# EAGLE design cry_gold (EAGLE 9.5.2)
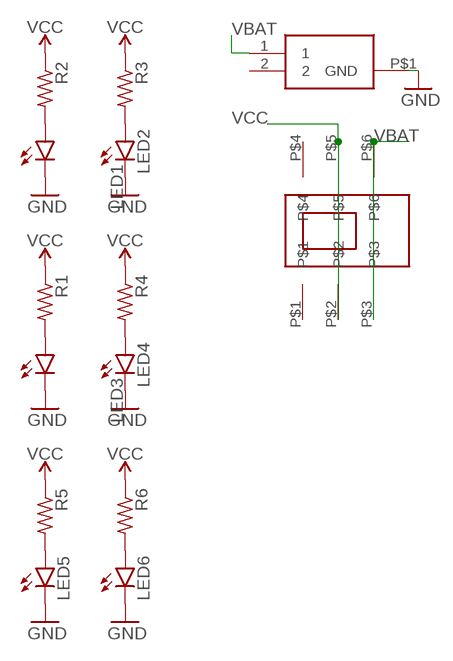
[diagram p0: schematic, sheet 1]

## Parts
LED1  LEDCHIP-LED0805  [CHIP-LED0805]
LED2  LEDCHIP-LED0805  [CHIP-LED0805]
LED3  LEDCHIP-LED0805  [CHIP-LED0805]
LED4  LEDCHIP-LED0805  [CHIP-LED0805]
LED5  LEDCHIP-LED0805  [CHIP-LED0805]
LED6  LEDCHIP-LED0805  [CHIP-LED0805]
R1  R-US_R0603  [R0603]
R2  R-US_R0603  [R0603]
R3  R-US_R0603  [R0603]
R4  R-US_R0603  [R0603]
R5  R-US_R0603  [R0603]
R6  R-US_R0603  [R0603]
U$1  CL-SB-22A-02T-SLIDE-SWITCH-TUCKED-PADS  [CL-SB-22A-02T-DPDT-COMPACT-SWITCH]
VBAT  BAT-HLD-012-SMT  [BATHLD012SMT]

## Nets
GND: LED1.C LED2.C LED3.C LED4.C LED5.C LED6.C VBAT.P$1(GND)
N$1: LED1.A R2.2
N$2: LED3.A R1.2
N$3: LED5.A R5.2
N$4: LED2.A R3.2
N$5: LED4.A R4.2
N$6: LED6.A R6.2
VBAT: U$1.P$3 U$1.P$6 VBAT.1
VCC: R1.1 R2.1 R3.1 R4.1 R5.1 R6.1 U$1.P$2 U$1.P$5
Unconnected: U$1.P$1 U$1.P$4 VBAT.2

## Library data of the parts
LED1-LED6 = led:LED: LED OSRAM: - CHIPLED LG R971, LG N971, LY N971, LG Q971, LY Q971, LO R971, LY R971 LH N974, LH R974 LS Q976, LO Q976, LY Q976 LO Q996 - Hyper CHIPLED LW Q18S LB Q993, LB Q99A, LB R99A - SideLED LS A670, LO A670, LY A670, LG A670, LP A670 LB A673, LV A673, LT A673, LW A673 LH A674 LY A675 LS A676, LA A676, LO A676, LY A676, LW A676 LS A679, LY A679, LG A679 - Hyper Micro SIDELED® LS Y876, LA Y876, LO Y876, LY Y876 LT Y87S - SmartLED LW L88C, LW L88S LB L89C, LB L89S, LG L890 LS L89K, LO L89K, LY L89K LS L896, LA L896, LO L896, LY L896 - TOPLED LS T670, LO T670, LY T670, LG T670, LP T670 LSG T670, LSP T670, LSY T670, LOP T670, LYG T670 LG T671, LOG T671, LSG T671 LB T673, LV T673, LT T673, LW T673 LH T674 LS T676, LA T676, LO T676, LY T676, LB T676, LH T676, LSB T676, LW T676 LB T67C, LV T67C, LT T67C, LS T67K, LO T67K, LY T67K, LW E67C LS E67B, LA E67B, LO E67B, LY E67B, LB E67C, LV E67C, LT E67C LW T67C LS T679, LY T679, LG T679 LS T770, LO T770, LY T770, LG T770, LP T770 LB T773, LV T773, LT T773, LW T773 LH T774 LS E675, LA E675, LY E675, LS T675 LS T776, LA T776, LO T776, LY T776, LB T776 LHGB T686 LT T68C, LB T68C - Hyper Mini TOPLED® LB M676 - Mini TOPLED Santana® LG M470 LS M47K, LO M47K, LY M47K Source: http://www.osram.convergy.de LUXEON: - LUMILED® LXK2-PW12-R00, LXK2-PW12-S00, LXK2-PW14-U00, LXK2-PW14-V00 LXK2-PM12-R00, LXK2-PM12-S00, LXK2-PM14-U00 LXK2-PE12-Q00, LXK2-PE12-R00, LXK2-PE12-S00, LXK2-PE14-T00, LXK2-PE14-U00 LXK2-PB12-K00, LXK2-PB12-L00, LXK2-PB12-M00, LXK2-PB14-N00, LXK2-PB14-P00, LXK2-PB14-Q00 LXK2-PR12-L00, LXK2-PR12-M00, LXK2-PR14-Q00, LXK2-PR14-R00 LXK2-PD12-Q00, LXK2-PD12-R00, LXK2-PD12-S00 LXK2-PH12-R00, LXK2-PH12-S00 LXK2-PL12-P00, LXK2-PL12-Q00, LXK2-PL12-R00 Source: www.luxeon.com KINGBRIGHT: KA-3528ASYC Source: www.kingbright.com
R1-R6 = rcl:R-US_: RESISTOR, American symbol; SPICEPREFIX: R
U$1 = electroninks:CL-SB-22A-02T-SLIDE-SWITCH-TUCKED-PADS
VBAT = SamacSys_Parts:BAT-HLD-012-SMT: Coin Cell Battery Holders Bat Hld CR1216/1225 Surface Mount Source: Datasheet <https://componentsearchengine.com/Datasheets/1/BAT-HLD-012-SMT.pdf>; DESCRIPTION: Coin Cell Battery Holders Bat Hld CR1216/1225 Surface Mount; HEIGHT: 3mm; MANUFACTURER_NAME: Linx Technologies; MANUFACTURER_PART_NUMBER: BAT-HLD-012-SMT; MOUSER_PART_NUMBER: 712-BAT-HLD-012-SMT; MOUSER_PRICE-STOCK: https://www.mouser.com/Search/Refine.aspx?Keyword=712-BAT-HLD-012-SMT

## Board
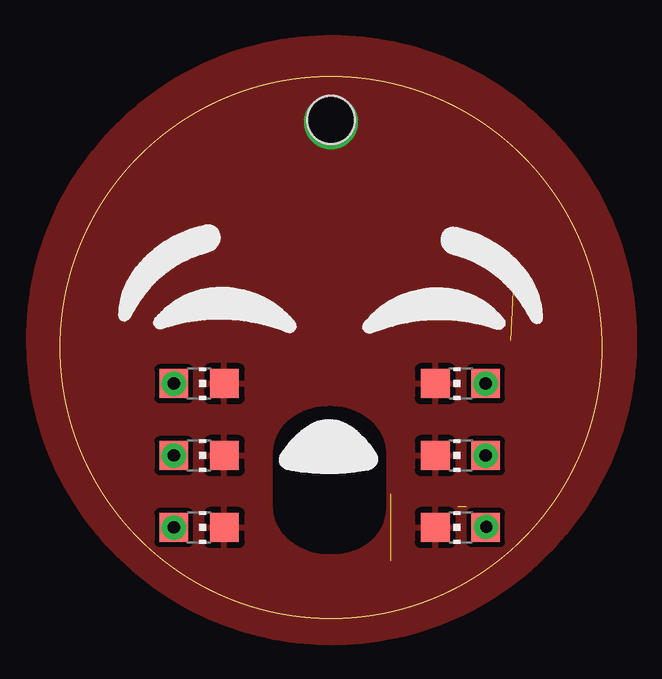
[diagram p1: board, top side]
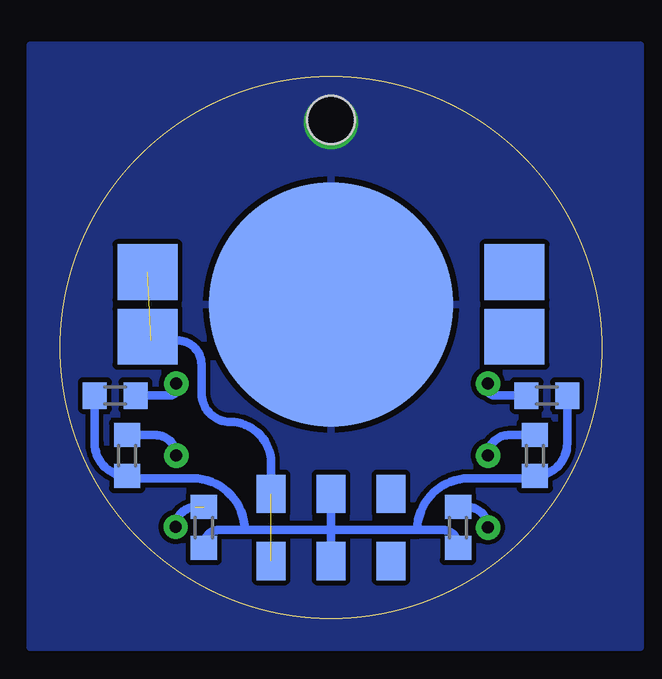
[diagram p2: board, bottom side, seen from below]

Size 22.6 x 22.6 mm. Coordinates in mm from the lower left corner, seen from the top.
Outline: circle at 11.3,11.3 radius 11.3
Copper layers (1*16): Top 0.035mm / dielectric 1.5mm / Bottom 0.035mm
Design rules "SparkFun *": minimum track width 8mil, minimum drill 20mil, track to track 8mil, track to pad 8mil, pad to pad 8mil, via to via 8mil, smd to smd 8mil, copper to edge 0mil, drill to drill 8mil, minimum pad ring 12mil, minimum via ring 10mil, stop-mask expansion 4mil, vias tented up to drill 1.6mm, thermal gap 10mil
Holes 2 mm at 11.3,20.8

### Footprints (pad centres in the part's own frame; a part is rotated, then mirrored left to right if it is on the bottom)
CHIP-LED0805 = smd 1.2 x 1.2: A 0,-1.05; C 0,1.05
R0603 = smd 1 x 1.1: 1 -0.85,0; 2 0.85,0
CL-SB-22A-02T-DPDT-COMPACT-SWITCH = smd 1.2 x 1.6: P$1 -2.5,-1.4; P$2 0,-1.4; P$3 2.5,-1.4; P$4 -2.5,1.4; P$5 0,1.4; P$6 2.5,1.4
BATHLD012SMT = smd 2.5 x 2.325: 1 -7.65,1.35; 2 7.65,1.35; P$2 -7.65,-1.35; P$3 7.65,-1.35 | smd 10.2 x 10.2: P$1 0,0

### Placement (x,y rotation side)
LED1  5.8,9.8 270 top
LED2  16.7,9.8 90 top
LED3  5.8,6.8 270 top
LED4  16.7,6.8 90 top
LED5  5.8,3.8 270 top
LED6  16.7,3.8 90 top
R1  2.8,6.8 90 bottom
R2  2.3,9.3 180 bottom
R3  20.3,9.3 0 bottom
R4  19.8,6.8 90 bottom
R5  6,3.8 90 bottom
R6  16.6,3.8 90 bottom
U$1  11.3,3.8 180 bottom
VBAT  11.3,13.1 0 bottom

### Tracks (layer width: path | path; a pad name or v marks a point on that pad's centre or on a via)
GND  (via drill 1.5)
  other vias: 11.3,20.7
  pour Bottom: -1.6,23.9 23.84,23.9 23.84,-1.2 -1.6,-1.2
  pour Top (rank 3): 11.33,24.28 11.01,24.28 10.69,24.27 10.38,24.25 10.06,24.22 9.85,24.2 9.53,24.16 9.22,24.11 8.91,24.05 8.6,23.99 8.29,23.92 8.03,23.85 7.73,23.77 7.42,23.67 7.12,23.57 6.82,23.46 6.53,23.35 6.24,23.22 5.99,23.11 5.71,22.98 5.42,22.83 5.15,22.68 4.87,22.52 4.6,22.36 4.33,22.19 4.2,22.1 4.03,21.98 3.77,21.79 3.52,21.6 3.27,21.4 3.02,21.2 2.79,20.99 2.59,20.81 2.37,20.59 2.14,20.36 1.93,20.13 1.75,19.93 1.54,19.69 1.34,19.44 1.15,19.19 0.96,18.93 0.78,18.67 0.7,18.54 0.58,18.36 0.42,18.09 0.26,17.82 0.1,17.54 -0.04,17.26 -0.18,16.97 -0.31,16.68 -0.41,16.44 -0.53,16.14 -0.64,15.85 -0.74,15.54 -0.84,15.24 -0.93,14.94 -1,14.63 -1.08,14.32 -1.13,14.06 -1.17,13.85 -1.22,13.54 -1.26,13.22 -1.3,12.91 -1.33,12.59 -1.35,12.28 -1.36,11.96 -1.36,11.64 -1.36,11.32 -1.35,11.11 -1.34,10.8 -1.31,10.48 -1.28,10.16 -1.24,9.85 -1.19,9.53 -1.13,9.22 -1.07,8.91 -1,8.6 -0.92,8.29 -0.83,7.99 -0.74,7.69 -0.63,7.39 -0.52,7.09 -0.41,6.79 -0.32,6.6 -0.26,6.45 -0.13,6.16 0.02,5.88 0.16,5.6 0.32,5.32 0.48,5.05 0.65,4.78 0.79,4.56 0.97,4.3 1.16,4.04 1.35,3.79 1.55,3.54 1.73,3.34 1.94,3.1 2.15,2.87 2.37,2.64 2.56,2.46 2.8,2.24 3.03,2.03 3.28,1.83 3.52,1.63 3.78,1.44 3.95,1.31 4.08,1.22 4.34,1.04 4.61,0.87 4.88,0.7 5.15,0.54 5.43,0.39 5.71,0.25 5.95,0.13 6.24,0 6.53,-0.12 6.83,-0.24 7.13,-0.35 7.43,-0.45 7.73,-0.54 7.99,-0.62 8.29,-0.7 8.6,-0.77 8.91,-0.83 9.23,-0.89 9.54,-0.94 9.85,-0.98 10.17,-1.01 10.49,-1.03 10.7,-1.05 11,-1.06 11.09,2.63 10.95,2.64 10.84,2.66 10.74,2.68 10.58,2.71 10.43,2.75 10.28,2.8 10.13,2.86 9.99,2.93 9.85,3.01 9.76,3.06 9.72,3.09 9.63,3.15 9.59,3.19 9.51,3.25 9.47,3.29 9.39,3.36 9.35,3.4 9.28,3.48 9.25,3.52 9.18,3.6 9.15,3.65 9.1,3.73 9.07,3.78 9.02,3.87 8.97,3.97 8.93,4.07 8.9,4.17 8.89,4.22 8.86,4.32 8.85,4.37 8.84,4.48 8.83,4.53 8.83,4.64 8.83,6.96 8.84,7.07 8.85,7.17 8.86,7.23 8.88,7.33 8.91,7.43 8.95,7.53 8.99,7.63 9.03,7.72 9.08,7.82 9.14,7.91 9.2,7.99 9.27,8.07 9.34,8.15 9.42,8.23 9.49,8.3 9.57,8.37 9.66,8.43 9.75,8.49 9.84,8.55 9.93,8.6 10.02,8.65 10.12,8.69 10.27,8.75 10.37,8.78 10.47,8.81 10.57,8.84 10.67,8.86 10.78,8.88 10.88,8.9 10.99,8.91 11.15,8.92 11.25,8.92 11.41,8.92 11.52,8.91 11.62,8.9 11.73,8.88 11.83,8.86 11.93,8.84 12.04,8.81 12.14,8.78 12.29,8.73 12.38,8.69 12.48,8.64 12.57,8.59 12.66,8.54 12.75,8.48 12.84,8.42 12.92,8.35 13,8.29 13.08,8.21 13.15,8.14 13.22,8.06 13.29,7.97 13.35,7.89 13.41,7.8 13.43,7.75 13.48,7.66 13.52,7.56 13.56,7.46 13.59,7.36 13.62,7.26 13.63,7.21 13.64,7.1 13.65,7 13.65,4.51 13.65,4.46 13.63,4.35 13.62,4.3 13.6,4.2 13.58,4.09 13.56,4.04 13.52,3.94 13.48,3.85 13.46,3.8 13.41,3.71 13.38,3.66 13.32,3.57 13.26,3.49 13.23,3.45 13.19,3.41 13.12,3.33 13.04,3.25 13.01,3.22 12.92,3.15 12.88,3.12 12.8,3.06 12.75,3.03 12.66,2.97 12.62,2.95 12.52,2.9 12.47,2.88 12.38,2.83 12.23,2.78 12.08,2.73 11.92,2.69 11.77,2.66 11.61,2.64 11.5,2.63 11.4,2.63 11.12,2.63 11.03,-1.06 11.33,-1.06 11.65,-1.06 11.97,-1.05 12.28,-1.03 12.6,-1 12.92,-0.96 13.23,-0.92 13.44,-0.89 13.75,-0.83 14.01,-0.78 14.32,-0.71 14.63,-0.63 14.93,-0.54 15.24,-0.45 15.54,-0.34 15.84,-0.23 16.13,-0.12 16.42,0.01 16.82,0.18 17.23,0.4 17.51,0.55 17.79,0.71 18.06,0.87 18.32,1.05 18.46,1.13 18.63,1.26 18.89,1.44 19.14,1.63 19.39,1.83 19.63,2.04 19.87,2.25 20.06,2.43 20.29,2.65 20.51,2.88 20.73,3.11 20.94,3.35 21.11,3.55 21.31,3.8 21.5,4.05 21.69,4.31 21.84,4.52 22.01,4.79 22.18,5.06 22.34,5.33 22.5,5.61 22.62,5.84 22.76,6.13 22.9,6.41 23.02,6.7 23.14,7 23.26,7.3 23.34,7.55 23.44,7.85 23.53,8.15 23.62,8.46 23.69,8.77 23.76,9.08 23.82,9.39 23.87,9.7 23.92,10.02 23.95,10.33 23.98,10.65 24,10.96 24.01,11.28 24.02,11.6 24.02,11.81 24.01,12.13 23.99,12.44 23.97,12.76 23.94,13.08 23.9,13.39 23.85,13.71 23.79,14.02 23.73,14.33 23.66,14.64 23.58,14.95 23.49,15.25 23.4,15.55 23.29,15.85 23.18,16.15 23.07,16.45 22.96,16.69 22.83,16.98 22.69,17.27 22.55,17.55 22.42,17.78 22.26,18.06 22.1,18.33 21.92,18.59 21.78,18.81 21.59,19.07 21.4,19.33 21.2,19.57 21,19.82 20.79,20.06 20.69,20.17 20.54,20.33 20.32,20.56 20.09,20.78 19.86,21 19.62,21.21 19.38,21.41 19.17,21.58 18.92,21.77 18.66,21.95 18.4,22.14 18.18,22.28 17.91,22.45 17.64,22.61 17.36,22.76 17.08,22.91 16.84,23.03 16.56,23.16 16.26,23.29 15.97,23.41 15.67,23.52 15.37,23.63 15.07,23.72 14.82,23.8 14.51,23.88 14.2,23.96 13.89,24.03 13.58,24.09 13.27,24.14 12.95,24.18 12.64,24.22 12.32,24.25 12.01,24.27 11.69,24.28 11.37,24.28
N$1  (via drill 0.51)
  Top 0.35: 4.75,9.58 LED1.A
  Bottom 0.35: R2.2 4.47,9.3 arc90 4.75,9.58 LED1.A
  other vias: 4.75,9.8
N$2  (via drill 0.51)
  Bottom 0.35: R1.2 3.9,7.65 arc-90 LED3.A
  other vias: 4.75,6.8
N$3  (via drill 0.51)
  Top 0.35: 4.67,3.88 arc90 LED5.A
  Bottom 0.35: R5.2 5.6,4.65 arc90 LED5.A
  other vias: 4.75,3.8
N$4  (via drill 0.51)
  Top 0.35: 17.75,9.58 LED2.A
  Bottom 0.35: R3.2 18.03,9.3 arc-90 17.75,9.58 LED2.A
  other vias: 17.75,9.8
N$5  (via drill 0.51)
  Bottom 0.35: R4.2 18.6,7.65 arc90 LED4.A
  other vias: 17.75,6.8
N$6  (via drill 0.51)  (1 unrouted)
  Top 0.35: v17.78,3.83 arc-90 LED6.A
  Bottom 0.35: 16.96,4.65 arc-90 v17.78,3.83
VBAT  (2 unrouted)
  Bottom 0.35: 13.8,5.46 U$1.P$3 13.8,6.5 arc-90 15.5,8.2 arc90 16.7,9.4 16.7,10.6 arc-90 17.7,11.6 18.8,11.6
VCC
  Bottom 0.35: U$1.P$5 11.3,3.7 | 11.3,3.7 U$1.P$2 | R5.1 arc-90 6.57,3.7 7.7,3.7 | 7.7,3.7 11.3,3.7 | R6.1 arc90 16.03,3.7 14.9,3.7 | 11.3,3.7 14.9,3.7 | 14.9,3.7 arc-90 17.05,5.85 19.7,5.85 R4.1 arc90 21.15,7.3 R3.1 | 7.7,3.7 arc90 5.55,5.85 2.9,5.85 R1.1 arc-90 1.45,7.3 R2.1